# EAGLE design networking-bridge (EAGLE 7.6.0)
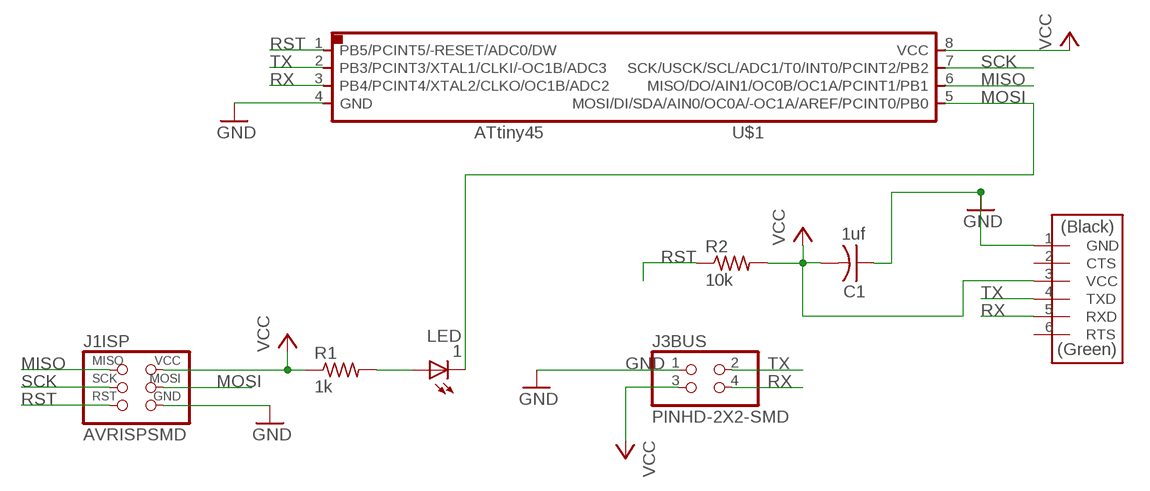
[diagram p0: schematic, sheet 1]

## Parts
1  LED  [LED1206]
C1  1uf  CAP-US1206FAB  [C1206FAB]
J1ISP  AVRISPSMD  [2X03SMD]
J3BUS  PINHD-2X2-SMD  [2X02SMD]
R1  1k  RES-US1206  [R1206]
R2  10k  RES-US1206  [R1206]
U$1  ATTINY45SI  [SOIC8]
U$2  FTDI-SMD-HEADER  [1X06SMD]

## Nets
GND: C1.1 J1ISP.6(GND) J3BUS.1 U$1.4(GND) U$2.1(GND)
MISO: J1ISP.1(MISO) U$1.6(MISO/DO/AIN1/OC0B/OC1A/PCINT1/PB1)
MOSI: 1.2(C) J1ISP.4(MOSI) U$1.5(MOSI/DI/SDA/AIN0/OC0A/-OC1A/AREF/PCINT0/PB0)
N$15: 1.1(A) R1.2
RST: J1ISP.5(RST) R2.1 U$1.1(PB5/PCINT5/-RESET/ADC0/DW)
RX: J3BUS.4 U$1.3(PB4/PCINT4/XTAL2/CLKO/OC1B/ADC2) U$2.5(RXD)
SCK: J1ISP.3(SCK) U$1.7(SCK/USCK/SCL/ADC1/T0/INT0/PCINT2/PB2)
TX: J3BUS.2 U$1.2(PB3/PCINT3/XTAL1/CLKI/-OC1B/ADC3) U$2.4(TXD)
VCC: C1.2 J1ISP.2(VCC) J3BUS.3 R1.1 R2.2 U$1.8(VCC) U$2.3(VCC)
Unconnected: U$2.2(CTS) U$2.6(RTS)

## Library data of the parts
1 = fab:LED: LED
C1 = fab:CAP-US
J1ISP = fab:AVRISP
J3BUS = fab:PINHD-2X2-SMD
R1 R2 = fab:RES-US: Resistor (US Symbol) Variants with postfix FAB are widened to allow the routing of internal traces
U$1 = fab:ATTINY45
U$2 = fab:FTDI-SMD-HEADER

## Board
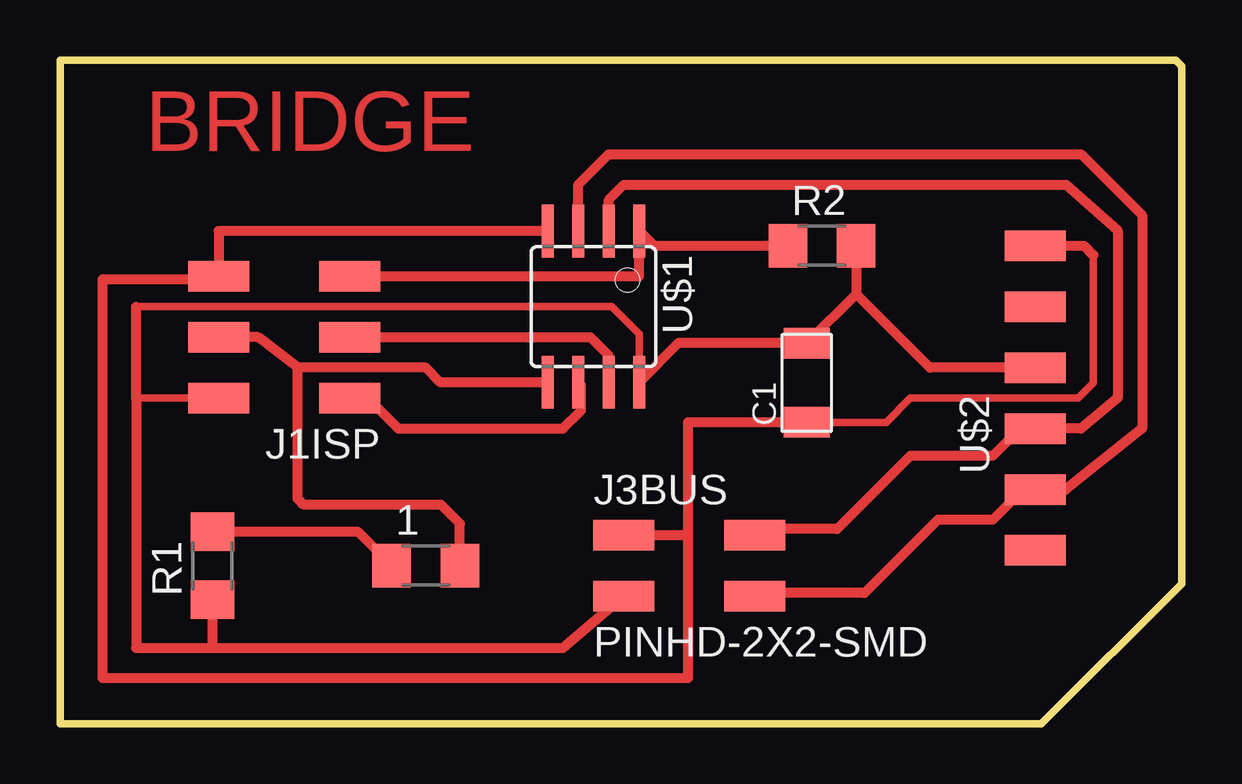
[diagram p1: board, top side]

Size 46.74 x 27.69 mm. Coordinates in mm from the lower left corner, seen from the top.
Outline: 0,27.69 0,0 40.89,0 46.74,5.84 46.74,27.43 46.48,27.69 0,27.69
Copper layers (1*16): Top 0.035mm / dielectric 1.5mm / Bottom 0.035mm
Design rules "default *": minimum track width 10mil, minimum drill 24mil, track to track 16mil, track to pad 16mil, pad to pad 16mil, via to via 16mil, smd to smd 16mil, copper to edge 40mil, drill to drill 8mil, minimum pad ring 10mil, minimum via ring 8mil, stop-mask expansion 4mil, vias tented up to drill 0mil, thermal gap 10mil

### Footprints (pad centres in the part's own frame; a part is rotated, then mirrored left to right if it is on the bottom)
LED1206 = smd 1.6 x 1.803: 1 -1.422,0; 2 1.422,0
C1206FAB = smd 1.27 x 1.905: 1 -1.651,0; 2 1.651,0
2X03SMD = smd 2.54 x 1.27: 1 -2.54,2.54; 2 2.92,2.54; 3 -2.54,0; 4 2.92,0; 5 -2.54,-2.54; 6 2.92,-2.54
2X02SMD = smd 2.54 x 1.27: 1 -2.54,1.27; 2 2.92,1.27; 3 -2.54,-1.27; 4 2.92,-1.27
R1206 = smd 1.6 x 1.803: 1 -1.422,0; 2 1.422,0
SOIC8 = smd 0.5 x 2.2: 1 -1.905,-3.154; 2 -0.645,-3.154; 3 0.625,-3.154; 4 1.895,-3.154; 5 1.905,3.154; 6 0.635,3.154; 7 -0.635,3.154; 8 -1.905,3.154
1X06SMD = smd 2.54 x 1.27: 1 0,6.35; 2 0,3.81; 3 0,1.27; 4 0,-1.27; 5 0,-3.81; 6 0,-6.35

### Placement (x,y rotation side)
1  15.24,6.6 0 top
C1  31.12,14.22 90 top
J1ISP  9.53,16.13 180 top
J3BUS  26.04,6.6 0 top
R1  6.35,6.6 90 top
R2  31.75,19.94 0 top
U$1  22.23,17.4 180 top
U$2  40.64,13.59 0 top

### Tracks (layer width: path | path; a pad name or v marks a point on that pad's centre or on a via)
GND
  Top 0.254: 23.37,7.57 J3BUS.1
  Top 0.305: C1.1 34.42,12.57 35.43,13.59 42.42,13.59 43.05,14.22 43.05,19.56
  Top 0.406: U$1.4 6.61,20.55 J1ISP.6 6.61,18.54 1.78,18.54 1.78,1.9 26.16,1.9 26.16,7.87 | C1.1 26.16,12.57 26.16,7.87 | U$2.1 42.67,19.94 43.05,19.56 | J3BUS.1 26.16,7.87
MISO
  Top 0.406: J1ISP.1 12.83,13.59 14.1,12.32 20.96,12.32 21.72,13.08 21.72,14.12 U$1.6
MOSI
  Top 0.406: U$1.5 15.85,14.24 15.24,14.86 9.91,14.86 | 9.91,14.86 8.25,16.13 J1ISP.4 | 1.2 16.66,8.36 15.88,9.14 10.16,9.14 9.91,9.4 9.91,14.86
N$15
  Top 0.406: R1.2 12.4,8.03 1.1
RST
  Top 0.406: R2.1 24.77,19.94 24.15,20.55 U$1.1 24.13,18.67 J1ISP.5
RX
  Top 0.254: 28.98,5.59 J3BUS.4 | 40.54,9.88 U$2.5
  Top 0.406: U$1.3 21.6,22.49 22.86,23.75 42.55,23.75 45.09,21.21 45.09,12.32 41.91,9.78 U$2.5 | 40.54,9.88 40.23,9.88 38.86,8.51 36.58,8.51 33.53,5.46 29.08,5.46 J3BUS.4
SCK
  Top 0.406: J1ISP.3 22.1,16.13 22.86,15.37 U$1.7 22.86,14.22 22.86,13.46
TX
  Top 0.254: 28.98,7.9 J3BUS.2 | 40.54,12.52 U$2.4
  Top 0.406: U$1.2 22.87,21.85 23.5,22.48 41.91,22.48 44.07,20.57 44.07,13.59 42.55,12.32 U$2.4 | 40.54,12.52 40.21,12.52 38.86,11.18 35.43,11.18 32.38,8.13 29.21,8.13 J3BUS.2
VCC
  Top 0.305: 5.08,13.59 J1ISP.2 3.17,13.59 | U$1.8 24.13,16.26 22.99,17.4 3.17,17.4
  Top 0.406: R2.2 33.17,17.93 | 33.17,17.93 C1.2 25.76,15.87 U$1.8 | U$2.3 36.25,14.86 33.17,17.93 | 6.35,3.17 3.17,3.17 3.17,13.59 3.17,17.4 | 6.35,3.17 20.96,3.17 J3BUS.3 | R1.1 6.35,3.17

### Text on the board
Top: BRIDGE